# EAGLE design RectifierBoard (EAGLE 6.6.0)
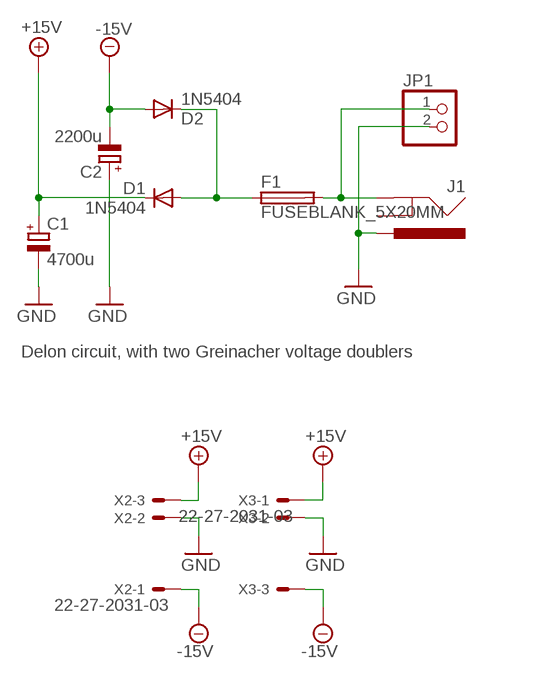
[diagram p0: schematic, sheet 1]

## Parts
C1  4700u  CPOL-EUE7.5-18  [E7,5-18]
C2  2200u  CPOL-EUE7.5-18  [E7,5-18]
D1  1N5404  DIODE1N4001  [DIODE-1N4001]
D2  1N5404  DIODE1N4001  [DIODE-1N4001]
F1  FUSEBLANK_5X20MM  [FUSE_HOLDER_5X20MM]
J1  POWER_JACKPTH  [POWER_JACK_PTH]
JP1  PINHD-1X2  [1X02]
X2  22-27-2031-03  [6410-03]
X3  22-27-2031-03  [6410-03]

## Nets
+15V: C1.+ D1.C X2.3 X3.1
-15V: C2.- D2.A X2.1 X3.3
GND: C1.- C2.+ J1.PWR JP1.2 X2.2 X3.2
N$1: D1.A D2.C F1.1
N$2: F1.2 J1.GND JP1.1
Unconnected: J1.GNDBREAK

## Notes on the sheet
- Delon circuit, with two Greinacher voltage doublers

## Library data of the parts
C1 C2 = resistor:CPOL-EU: POLARIZED CAPACITOR, European symbol
D1 D2 = Rebel:DIODE: Diode These are standard reverse protection diodes and small signal diodes. SMA package can handle up to about 1A. SOD-323 can handle about 200mA. Watch the SOD-323 package when ordering, there are some mfgs out there that are 5-pin packages.
F1 = fuse:FUSE: Fuse; OC_FARNELL: unknown; OC_NEWARK: unknown
J1 = SparkFun:POWER_JACK: Power Jack This is the standard 5.5mm barrel jack for power. The PTH is the most common, proven, reliable, footprint. All others are experimental. The Slot footprint only works if the mill layer is transmitted to the PCB fab house so be warned. Spark Fun Electronics SKU : PRT-00119. Mating wall wart : TOL-00298 (and others)
JP1 = pinhead:PINHD-1X2: PIN HEADER
X2 X3 = con-molex:22-?-03: CONNECTOR wire to board 2.54 mm (.1 inch) pitch header; OC_FARNELL: unknown; OC_NEWARK: unknown

## Board
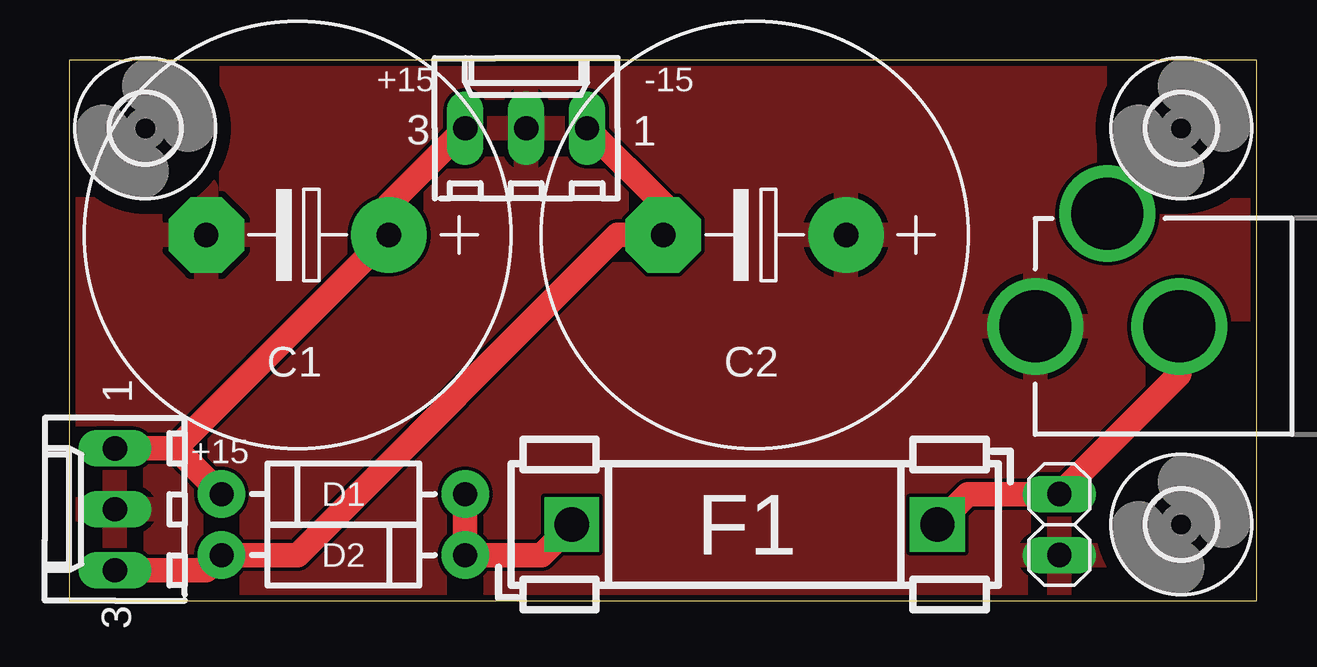
[diagram p1: board, top side]
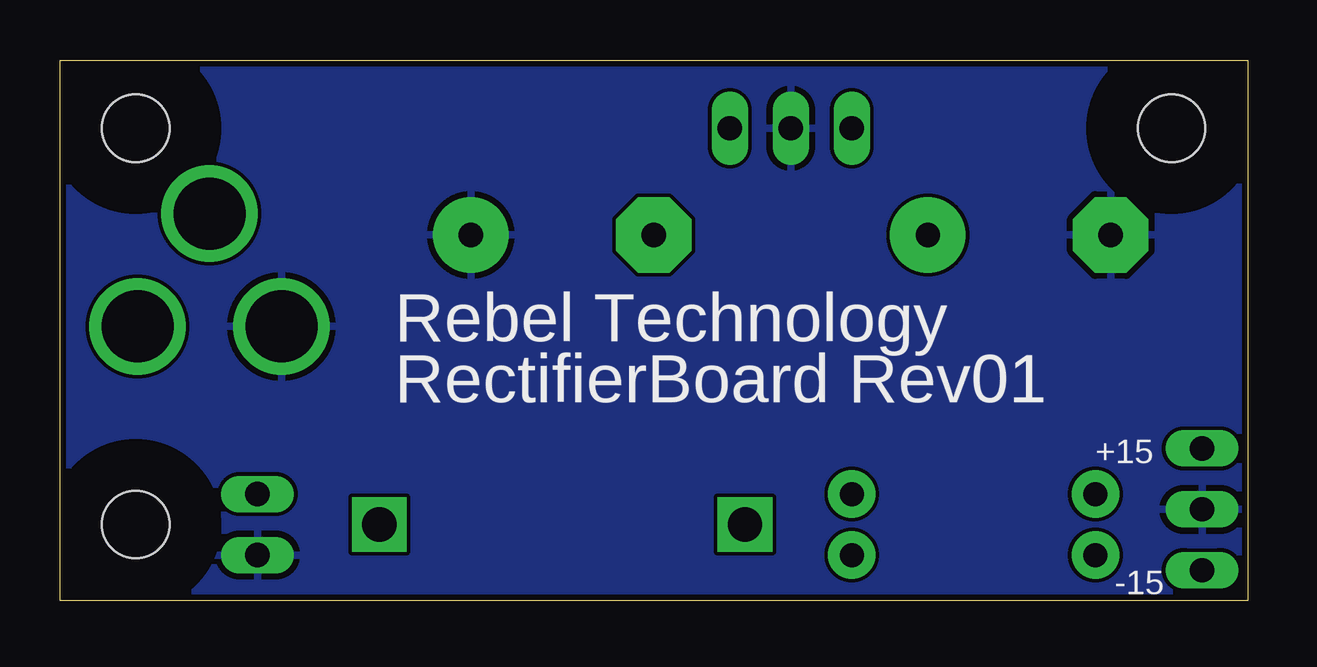
[diagram p2: board, bottom side, seen from below]

Size 49.51 x 22.53 mm. Coordinates in mm from the lower left corner, seen from the top.
Outline: 0,0 49.51,0 49.51,22.53 0,22.53 0,0
Copper layers (1*16): Top 0.035mm / dielectric 1.5mm / Bottom 0.035mm
Design rules "Fusion_eagle_rule_v1.1": minimum track width 6mil, minimum drill 12mil, track to track 6mil, track to pad 6mil, pad to pad 6mil, via to via 6mil, smd to smd 0mil, copper to edge 10mil, drill to drill 10mil, minimum pad ring 10mil, minimum via ring 6mil, stop-mask expansion 2mil, vias tented up to drill 100mil, thermal gap 10mil

### Footprints (pad centres in the part's own frame; a part is rotated, then mirrored left to right if it is on the bottom)
E7,5-18 = drill 1.016 pad 3.15: + -3.81,0 | drill 1.016 pad 3.15 octagon: - 3.81,0
DIODE-1N4001 = drill 1 pad 1.981: A -5.08,0; C 5.08,0
FUSE_HOLDER_5X20MM = drill 1.422 pad 2.286 square: 1 0,0; 2 15.24,0
POWER_JACK_PTH = drill 2.997: GND 0,7.7; GNDBREAK 4.7,10.7; PWR 0,13.7
1X02 = drill 1.016 long: 1 -1.27,0; 2 1.27,0
2,8 = hole 2.8: 0,0
6410-03 = drill 1.016 long: 1 2.54,0; 2 0,0; 3 -2.54,0

### Placement (x,y rotation side)
C1  9.52,15.24 180 top
C2  28.57,15.24 180 top
D1  11.43,4.45 180 top
D2  11.43,1.91 0 top
F1  20.96,3.17 0 top
J1  53.98,11.43 90 top
JP1  41.27,3.17 270 top
U$1  [2,8]  46.36,3.17 0 top
U$2  [2,8]  46.36,19.68 0 top
U$3  [2,8]  3.17,19.68 0 top
X2  19.05,19.68 0 top
X3  1.91,3.81 90 top

### Tracks (layer width: path | path; a pad name or v marks a point on that pad's centre or on a via)
+15V
  Top 1.016: X2.3 13.34,16.51 C1.+ 4.45,6.35 | X3.1 4.45,6.35 | D1.C 4.45,6.35
-15V
  Top 1.016: X3.3 5.72,1.27 D2.A 9.52,1.91 22.86,15.24 C2.- 24.77,16.51 X2.1
GND
  pour Bottom: -1.27,25.4 52.7,25.4 52.7,0 -1.27,0
  pour Top: -1.27,24.13 51.44,24.13 51.44,-1.27 -1.27,-1.27
N$1
  Top 1.016: F1.1 19.69,1.91 D2.C D1.A
N$2
  Top 1.016: J1.GND 46.27,9.45 JP1.1 37.47,4.45 F1.2

### Text on the board
tPlace: +15 | -15 | +15
bPlace: Rebel Technology | RectifierBoard Rev01 | +15 | -15